# Altium project UWB_Project.PrjPCB
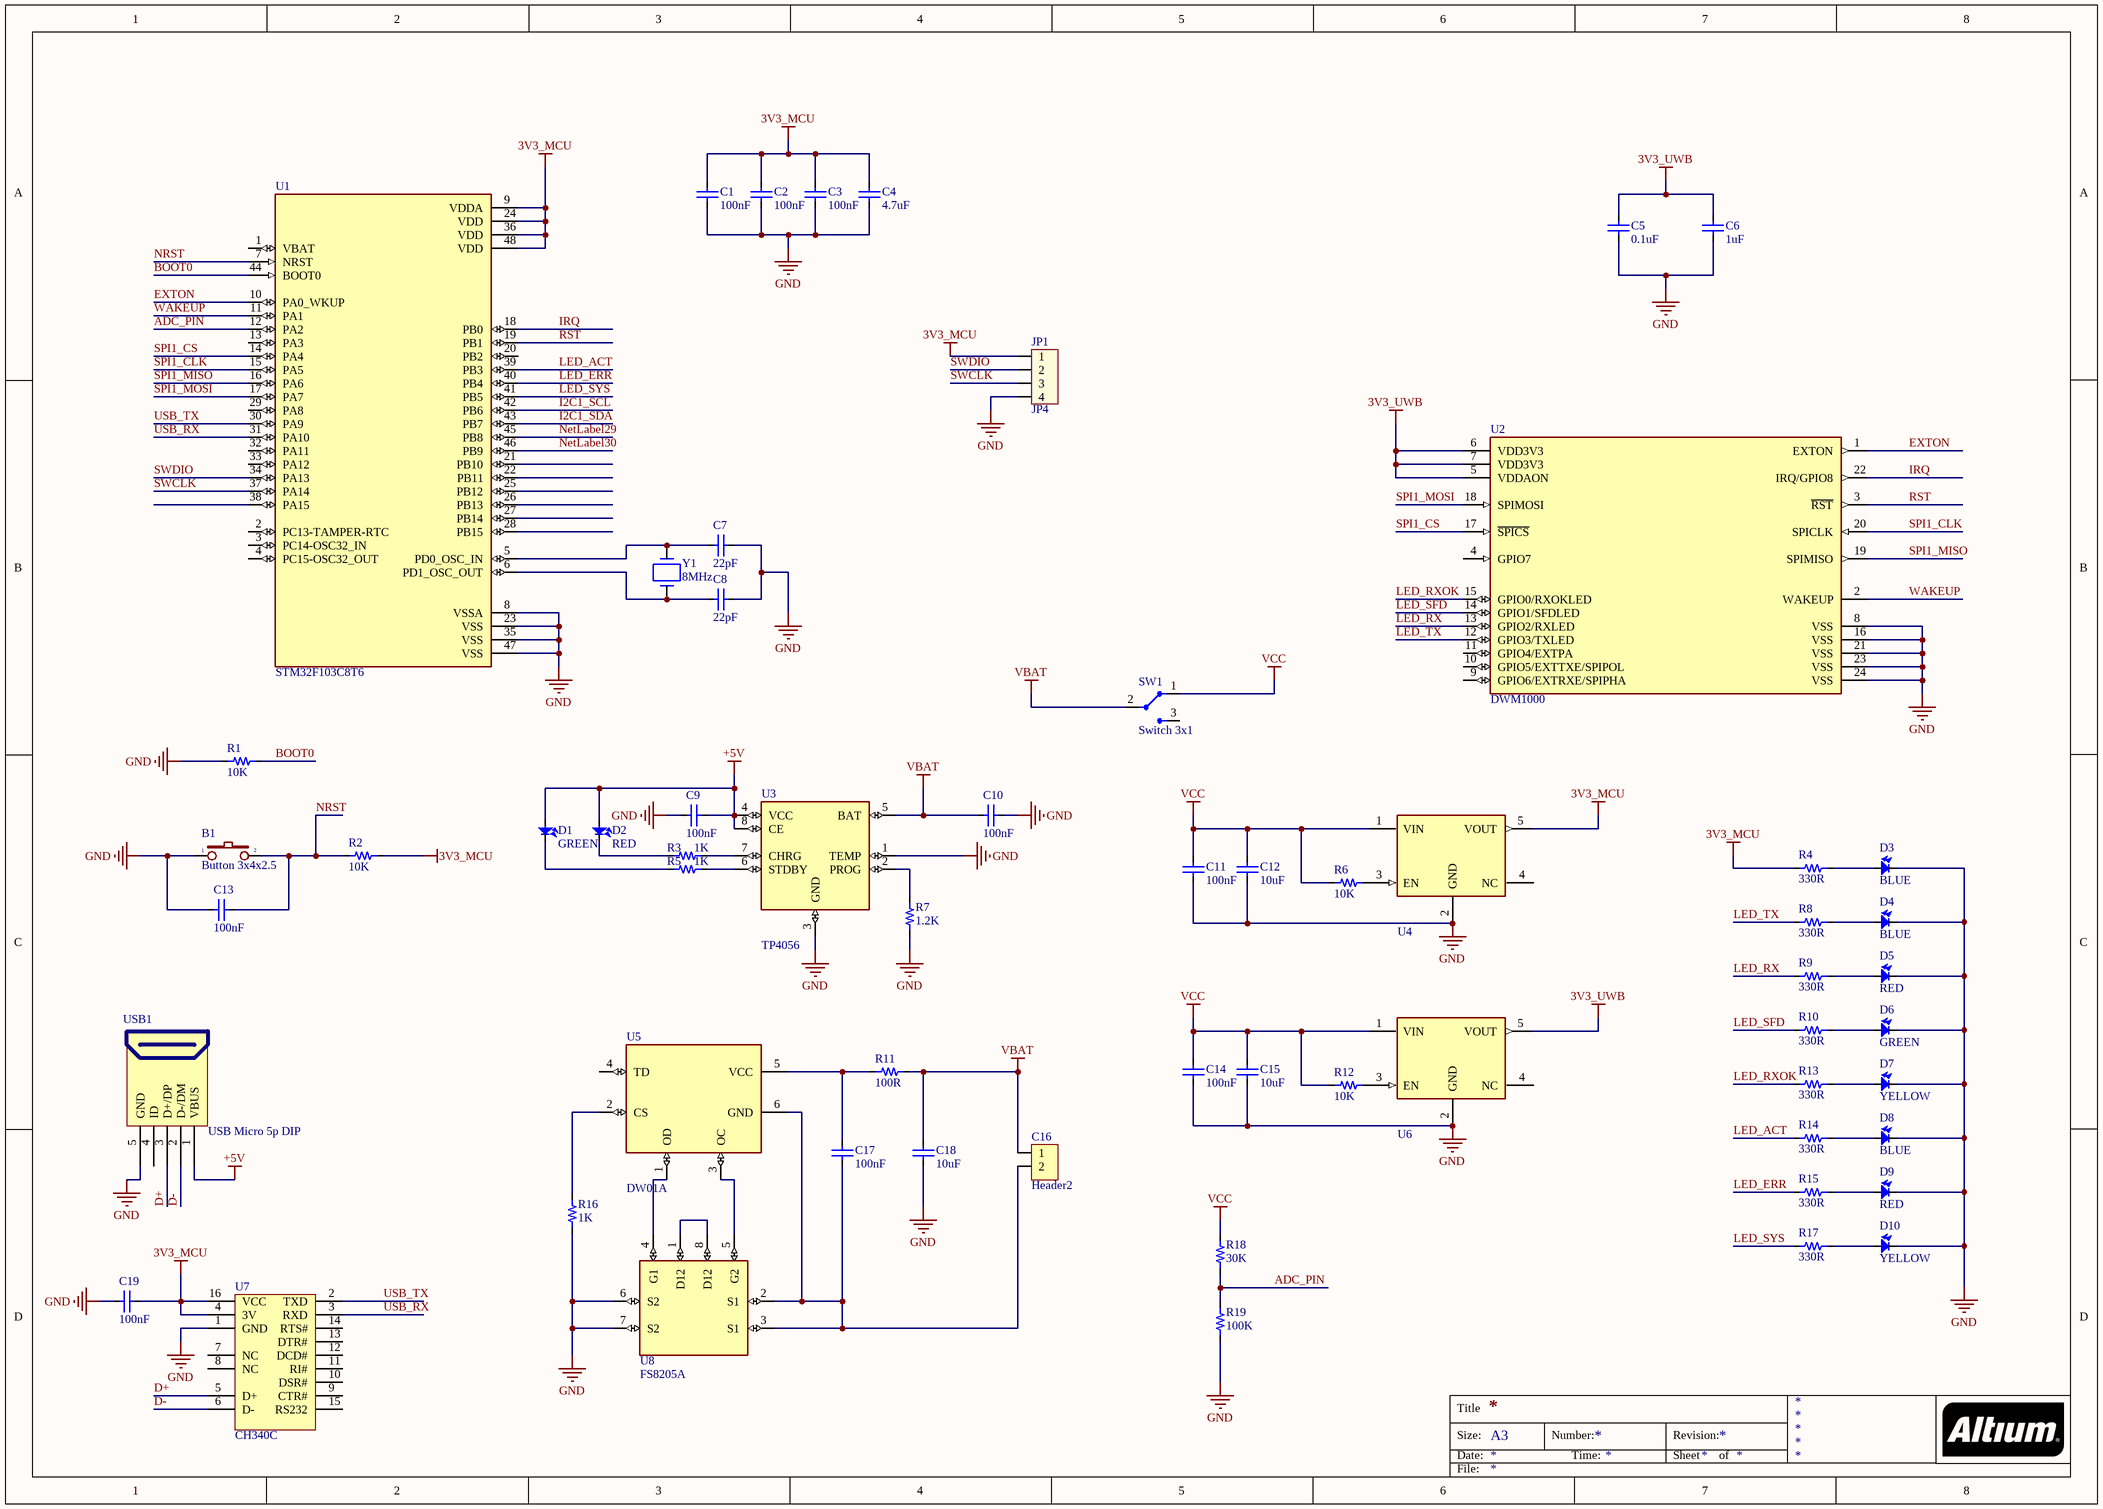
[diagram p0: UWB_Project.SchDoc]
1 sheet, 61 parts. Net scope: global (net labels, ports and power ports of the same name join across sheets).
Board file: UWB_PCB.PcbDoc

## Sheet UWB_Project.SchDoc
size A3

### Parts
B1  Button 3x4x2.5  [Button 3x4x2.5]
C1  100nF  [CAP_0805]
C2  100nF  [CAP_0805]
C3  100nF  [CAP_0805]
C4  4.7uF  [CAP_0805]
C5  0.1uF  [CAP_0805]
C6  1uF  [CAP_0805]
C7  22pF  [CAP_0805]
C8  22pF  [CAP_0805]
C9  100nF  [CAP_0805]
C10  100nF  [CAP_0805]
C11  100nF  [CAP_0805]
C12  10uF  [CAP_0805]
C13  100nF  [CAP_0805]
C14  100nF  [CAP_0805]
C15  10uF  [CAP_0805]
C16  Header2  [HEAD2P-1.25]
C17  100nF  [CAP_0805]
C18  10uF  [CAP_0805]
C19  100nF  [CAP_0805]
D1  GREEN  [LED-0805-Green]
D2  RED  [LED-0805-Red]
D3  BLUE  [LED-0805-Blue]
D4  BLUE  [LED-0805-Red]
D5  RED  [LED-0805-Green]
D6  GREEN  [LED-0805-Yellow]
D7  YELLOW  [LED-0805-Yellow]
D8  BLUE  [LED-0805-Yellow]
D9  RED  [LED-0805-Yellow]
D10  YELLOW  [LED-0805-Yellow]
JP1  JP4  [HEADER4P-1.25]
R1  10K  [RES-SMD-0805]
R2  10K  [RES-SMD-0805]
R3  1K  [RES-SMD-0805]
R4  330R  [RES-SMD-0805]
R5  1K  [RES-SMD-0805]
R6  10K  [RES-SMD-0805]
R7  1.2K  [RES-SMD-0805]
R8  330R  [RES-SMD-0805]
R9  330R  [RES-SMD-0805]
R10  330R  [RES-SMD-0805]
R11  100R  [RES-SMD-0805]
R12  10K  [RES-SMD-0805]
R13  330R  [RES-SMD-0805]
R14  330R  [RES-SMD-0805]
R15  330R  [RES-SMD-0805]
R16  1K  [RES-SMD-0805]
R17  330R  [RES-SMD-0805]
R18  30K  [RES-SMD-0805]
R19  100K  [RES-SMD-0805]
SW1  Switch 3x1  [SLIDE_SW]
U1  STM32F103C8T6  [STM32F103C8T6]
U2  DWM1000  [DW1000]
U3  TP4056  [TP4056]
U4  RT9013  [RT9013]  (value not drawn)
U5  DW01A  [SOT23-6]
U6  RT9013  [RT9013]  (value not drawn)
U7  CH340C  [SO16]
U8  FS8205A  [FS8205A]
USB1  USB Micro 5p DIP  [USB Micro 5p DIP]
Y1  8MHz  [ABM7_v1_1_BIG]

### Nets
3V3_MCU: C1.2 C2.2 C3.2 C4.2 C19.2 JP1.1 R2.2 R4.1 U1.9(VDDA) U1.24(VDD) U1.36(VDD) U1.48(VDD) U4.5(VOUT) U7.4(3V) U7.16(VCC)
3V3_UWB: C5.2 C6.2 U2.5(VDDAON) U2.6(VDD3V3) U2.7(VDD3V3) U6.5(VOUT)
+5V: C9.2 D1.1 D2.1 U3.4(VCC) U3.8(CE) USB1.1(VBUS)
GND: B1.1 C1.1 C2.1 C3.1 C4.1 C5.1 C6.1 C7.2 C8.2 C9.1 C10.2 C11.1 C12.1 C13.1 C14.1 C15.1 C18.1 C19.1 D3.2 D4.2 D5.2 D6.2 D7.2 D8.2 D9.2 D10.2 JP1.4 R1.1 R7.1 R16.1 R19.1 U1.8(VSSA) U1.23(VSS) U1.35(VSS) U1.47(VSS) U2.8(VSS) U2.16(VSS) U2.21(VSS) U2.23(VSS) U2.24(VSS) U3.1(TEMP) U3.3(GND) U4.2(GND) U6.2(GND) U7.1(GND) U8.6(S2) U8.7(S2) USB1.5(GND)
VBAT: C10.1 C16.1 C18.2 R11.2 SW1.2 U3.5(BAT)
VCC: C11.2 C12.2 C14.2 C15.2 R6.2 R12.2 R18.2 SW1.1 U4.1(VIN) U6.1(VIN)
ADC_PIN: R18.1 R19.2 U1.12(PA2)
BOOT0: R1.2 U1.44(BOOT0)
D+: U7.5(D+) USB1.3(D+/DP)
D-: U7.6(D-) USB1.2(D-/DM)
EXTON: U1.10(PA0_WKUP) U2.1(EXTON)
I2C1_SCL: U1.42(PB6)
I2C1_SDA: U1.43(PB7)
IRQ: U1.18(PB0) U2.22(IRQ/GPIO8)
LED_ACT: R14.1 U1.39(PB3)
LED_ERR: R15.1 U1.40(PB4)
LED_RX: R9.1 U2.13(GPIO2/RXLED)
LED_RXOK: R13.1 U2.15(GPIO0/RXOKLED)
LED_SFD: R10.1 U2.14(GPIO1/SFDLED)
LED_SYS: R17.1 U1.41(PB5)
LED_TX: R8.1 U2.12(GPIO3/TXLED)
NetLabel29: U1.45(PB8)
NetLabel30: U1.46(PB9)
NRST: B1.2 C13.2 R2.1 U1.7(NRST)
RST: U1.19(PB1) U2.3(~{RST})
SPI1_CLK: U1.15(PA5) U2.20(SPICLK)
SPI1_CS: U1.14(PA4) U2.17(~{SPICS})
SPI1_MISO: U1.16(PA6) U2.19(SPIMISO)
SPI1_MOSI: U1.17(PA7) U2.18(SPIMOSI)
SWCLK: JP1.3 U1.37(PA14)
SWDIO: JP1.2 U1.34(PA13)
USB_RX: U1.31(PA10) U7.3(RXD)
USB_TX: U1.30(PA9) U7.2(TXD)
WAKEUP: U1.11(PA1) U2.2(WAKEUP)
NetC7_1: C7.1 U1.5(PD0_OSC_IN) Y1.2
NetC8_1: C8.1 U1.6(PD1_OSC_OUT) Y1.1
NetC16_2: C16.2 C17.1 U5.6(GND) U8.2(S1) U8.3(S1)
NetC17_2: C17.2 R11.1 U5.5(VCC)
NetD1_2: D1.2 R5.1
NetD2_2: D2.2 R3.1
NetD3_1: D3.1 R4.2
NetD4_1: D4.1 R8.2
NetD5_1: D5.1 R9.2
NetD6_1: D6.1 R10.2
NetD7_1: D7.1 R13.2
NetD8_1: D8.1 R14.2
NetD9_1: D9.1 R15.2
NetD10_1: D10.1 R17.2
NetR3_2: R3.2 U3.7(CHRG)
NetR5_2: R5.2 U3.6(STDBY)
NetR6_1: R6.1 U4.3(EN)
NetR7_2: R7.2 U3.2(PROG)
NetR12_1: R12.1 U6.3(EN)
NetR16_2: R16.2 U5.2(CS)
NetU5_1: U5.1(OD) U8.4(G1)
NetU5_3: U5.3(OC) U8.5(G2)
NetU8_1: U8.1(D12) U8.8(D12)

Not connected (* = marked no-connect by the designer): SW1 3(I/O2); U1 1(VBAT) 2(PC13-TAMPER-RTC) 3(PC14-OSC32_IN) 4(PC15-OSC32_OUT) 13(PA3) 20(PB2) 21(PB10) 22(PB11) 25(PB12) 26(PB13) 27(PB14) 28(PB15) 29(PA8) 32(PA11) 33(PA12) 38(PA15); U2 4(GPIO7) 9(GPIO6/EXTRXE/SPIPHA) 10(GPIO5/EXTTXE/SPIPOL) 11(GPIO4/EXTPA); U4 4(NC); U5 4(TD); U6 4(NC); U7 7(NC) 8(NC) 9(CTR#) 10(DSR#) 11(RI#) 12(DCD#) 13(DTR#) 14(RTS#) 15(RS232); USB1 4(ID)

### Notes on the sheet
- Title
- Size:
- Date:
- A3
- Number:
- Time:
- Revision:
- Sheet
- of
- File:

### Library data of the parts
C1-C15 C17-C19 = CapSMD: Capacitor; Value: 33p; Published: 8-Jun-2000; LatestRevisionDate: 17-Jul-2002; LatestRevisionNote: Re-released for DXP Platform.; PackageReference: RAD-0.3; Publisher: Altium Limited
C16 = Header2: Header IDC, 2 x 1 Pin Vertical 2.54mm Pitch (Non-Boxed, Male); Manufacturer: W¨¹rth Elektronik eiSos GmbH; partNo: 613002143121; ComponentLink1 Description: Manufacturer; ComponentLink2 Description: Datasheet; NoPins: 02; Created Date: 29 March 2013; ComponentLink1URL: http://www.we-online.com; ComponentLink2URL: http://katalog.we-online.de/em/datasheet/6130xx143121.pdf; Created by: Karrer Zheng
D1-D10 = LED: LED Single colour Green and Red; Value: LED 3 ly Single Colour
JP1 = Con4: Connector 4; Value: Connector 4
R1-R19 = Resistor - SMD: Resistor; Manufacturer: Generic Components; Class: Passive; Published: 08/06/2000; Publisher: Altium Hobart Technology Centre
SW1 = SW3x1: Value: Switch 4x2
U1 = STM32F103C8T6: Mainstream Performance line, ARM Cortex-M3 MCU with 64 Kbytes Flash, 72 MHz CPU, motor control, USB and CAN
U2 = DWM1000: Decawave's DW1000 Ultra / Wideband (UWB) transceiver IC
U3 = TP4056: Complete single cell Li-Ion battery with a constant current / constant voltage linear charger
U5 = DW01A: One Cell Lithium-ion/Polymer Battery Protection IC
USB1 = USB Micro 5p DIP: USB Type B; Ten: MicroUSB MK5P DIP; Ma_Hang: MH005145
Y1 = ABM7-16.000MHZ-D2Y-T: CRYSTAL 16MHZ 18PF SMD; Manufacturer: Abracon LLC; Frequency Stability: ±30ppm; Frequency Tolerance: ±20ppm; ESR (Equivalent Series Resistance): 50 Ohm; Operating Mode: Fundamental; .Creator: MM; .Checked PCB: RF; Supplier 1: Digi-Key; Manufacturer Part Number: ABM7-16.000MHZ-D2Y-T; RoHS: RoHS Compliant; Category: Crystals and Oscillators; Stock 1: 5861; Pricing 1: 1=0.96, 10=0.847, 50=0.791, 100=0.7, 500=0.6615 (USD); Packaging: Cut Tape (CT); Type: MHz Crystal; Frequency: 16MHz; Load Capacitance: 18pF; Operating Temperature: -40°C ~ 85°C; Ratings: -; Mounting Type: Surface Mount; Package / Case: 2-SMD; Size / Dimension: 0.236" L x 0.138" W (6.00mm x 3.50mm); Height: 0.055" (1.40mm); ComponentLink1URL: http://www.abracon.com/Resonators/abm7.pdf; ComponentLink1Description: http://www.abracon.com/Resonators/abm7.pdf; Supplier Part Number 1: 535-9840-1-ND; .Checked SCH: RF